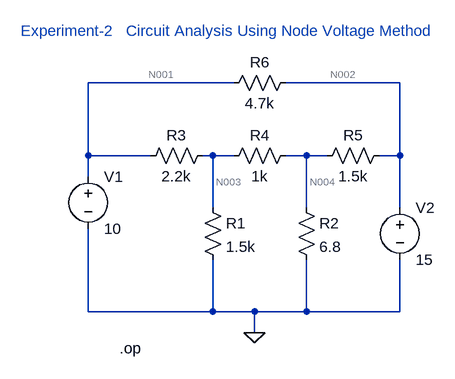
[diagram p0: schematic Draft10.asc]
Draft10.asc, the LTspice schematic file:
Version 4
SHEET 1 880 680
WIRE 208 -16 -16 -16
WIRE 464 -16 288 -16
WIRE -16 96 -16 -16
WIRE 80 96 -16 96
WIRE 176 96 160 96
WIRE 208 96 176 96
WIRE 320 96 288 96
WIRE 352 96 320 96
WIRE 464 96 464 -16
WIRE 464 96 432 96
WIRE -16 128 -16 96
WIRE 176 176 176 96
WIRE 320 176 320 96
WIRE 464 176 464 96
WIRE -16 336 -16 208
WIRE 176 336 176 256
WIRE 176 336 -16 336
WIRE 240 336 176 336
WIRE 320 336 320 256
WIRE 320 336 240 336
WIRE 464 336 464 256
WIRE 464 336 320 336
WIRE 240 368 240 336
FLAG 240 368 0
SYMBOL voltage -16 112 R0
SYMATTR InstName V1
SYMATTR Value 10
SYMBOL res 160 160 R0
SYMATTR InstName R1
SYMATTR Value 1.5k
SYMBOL res 304 160 R0
SYMATTR InstName R2
SYMATTR Value 6.8
SYMBOL voltage 464 160 R0
SYMATTR InstName V2
SYMATTR Value 15
SYMBOL res 176 80 R90
WINDOW 0 0 56 VBottom 2
WINDOW 3 32 56 VTop 2
SYMATTR InstName R3
SYMATTR Value 2.2k
SYMBOL res 304 80 R90
WINDOW 0 0 56 VBottom 2
WINDOW 3 32 56 VTop 2
SYMATTR InstName R4
SYMATTR Value 1k
SYMBOL res 448 80 R90
WINDOW 0 0 56 VBottom 2
WINDOW 3 32 56 VTop 2
SYMATTR InstName R5
SYMATTR Value 1.5k
SYMBOL res 304 -32 R90
WINDOW 0 0 56 VBottom 2
WINDOW 3 32 56 VTop 2
SYMATTR InstName R6
SYMATTR Value 4.7k
TEXT -120 -96 Left 2 ;Experiment-2   Circuit Analysis Using Node Voltage Method
TEXT 32 392 Left 2 !.op

The netlist it stands for:
* Draft10.asc
V1 N001 0 10
R1 N003 0 1.5k
R2 N004 0 6.8
V2 N002 0 15
R3 N003 N001 2.2k
R4 N004 N003 1k
R5 N002 N004 1.5k
R6 N002 N001 4.7k
* Experiment-2   Circuit Analysis Using Node Voltage Method
.op
.backanno
.end

* Results of the author's LTspice run, read from the files saved beside the schematic
* Operating Point:
*   V(n001) = 10 V
*   V(n003) = 2.181 V
*   V(n004) = 81.91 mV
*   V(n002) = 15 V
*   I(R1) = 1.454 mA
*   I(R2) = 12.04 mA
*   I(R3) = -3.554 mA
*   I(R4) = -2.1 mA
*   I(R5) = 9.945 mA
*   I(R6) = 1.064 mA
*   I(V1) = -2.49 mA
*   I(V2) = -11.01 mA